# Altium project LP_ECG-X02.PrjPcb (part 1 of 3)
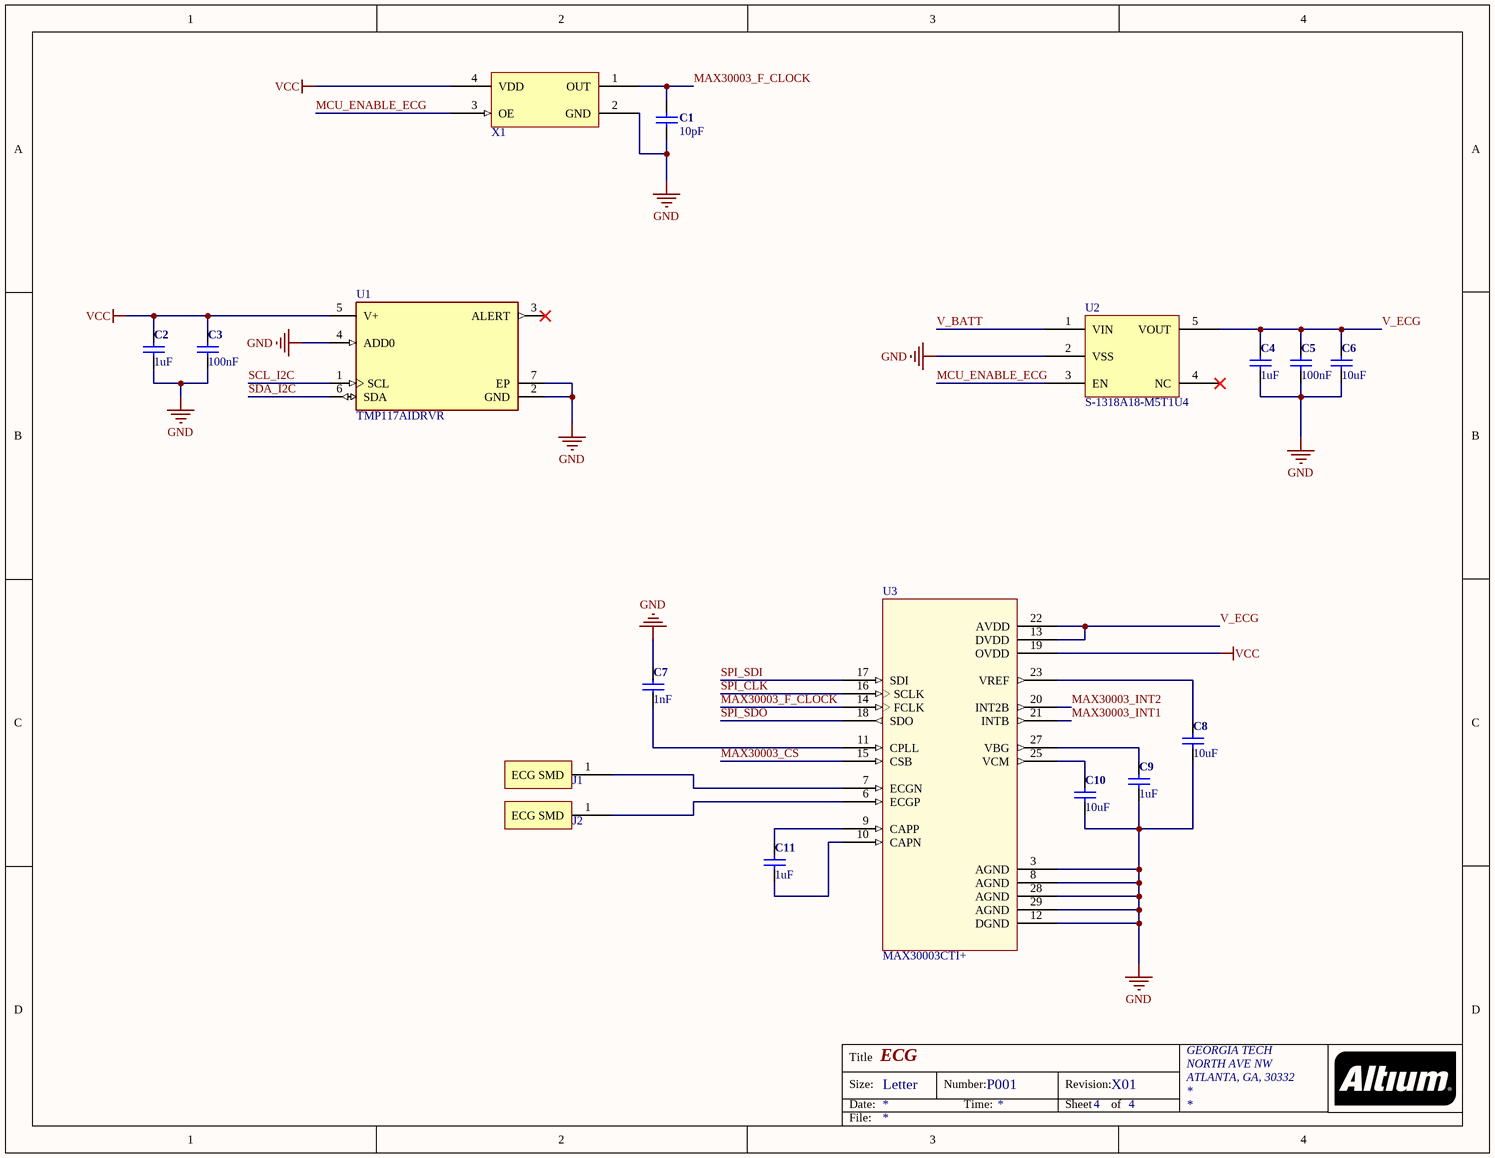
[diagram p0: LP_ECG_ECG-X02.SchDoc]
Author: C. DEMOLDER
3 sheets, 71 parts. Net scope: global (net labels, ports and power ports of the same name join across sheets).
Board file: LP_ECG-X02.PcbDoc
Sheets:
  LP_ECG_ECG-X02.SchDoc
  LP_ECG_Main-X02.SchDoc
  LP_ECG_Power-X02.SchDoc

## Sheet LP_ECG_ECG-X02.SchDoc: ECG
size Letter; Organization: GEORGIA TECH; Address1: NORTH AVE NW; Address2: ATLANTA, GA, 30332; DocumentNumber: P001; Revision: X01; SheetNumber: 4; SheetTotal: 4

### Parts
C1  10pF  [C0402]
C2  1uF  [C0402]
C3  100nF  [C0402]
C4  1uF  [C0402]
C5  100nF  [C0402]
C6  10uF  [C0402]
C7  1nF  [C0402]
C8  10uF  [C0402]
C9  1uF  [C0402]
C10  10uF  [C0402]
C11  1uF  [C0402]
J1  ECG_SMD_CONNECTOR  [ecg_connector]  (value not drawn)
J2  ECG_SMD_CONNECTOR  [ecg_connector]  (value not drawn)
U1  TMP117AIDRVR  [TMP117AIDRVR]
U2  S-1318A18-M5T1U4  [SOT-23-5]
U3  MAX30003CTI+  [QFN50P500X500X80-29N]
X1  OSCILLATOR-32.768KHZ  [OM-7605-C8-32.768KHZ]  (value not drawn)

### Nets
GND: C1.2 C2.2 C3.1 C4.2 C5.1 C6.2 C7.1 C8.2 C9.2 C10.2 U1.2(GND) U1.4(ADD0) U1.7(EP) U2.2(VSS) U3.3(AGND) U3.8(AGND) U3.12(DGND) U3.28(AGND) U3.29(AGND) X1.2(GND)
VCC: C2.1 C3.2 U1.5(V+) U3.19(OVDD) X1.4(VDD)
MAX30003_CS: U3.15(CSB)
MAX30003_F_CLOCK: C1.1 U3.14(FCLK) X1.1(OUT)
MAX30003_INT1: U3.21(INTB)
MAX30003_INT2: U3.20(INT2B)
MCU_ENABLE_ECG: U2.3(EN) X1.3(OE)
SCL_I2C: U1.1(SCL)
SDA_I2C: U1.6(SDA)
SPI_CLK: U3.16(SCLK)
SPI_SDI: U3.17(SDI)
SPI_SDO: U3.18(SDO)
V_BATT: U2.1(VIN)
V_ECG: C4.1 C5.2 C6.1 U2.5(VOUT) U3.13(DVDD) U3.22(AVDD)
NetC7_2: C7.2 U3.11(CPLL)
NetC8_1: C8.1 U3.23(VREF)
NetC9_1: C9.1 U3.27(VBG)
NetC10_1: C10.1 U3.25(VCM)
NetC11_1: C11.1 U3.9(CAPP)
NetC11_2: C11.2 U3.10(CAPN)
NetJ1_1: J1.1(ECG_SMD) U3.7(ECGN)
NetJ2_1: J2.1(ECG_SMD) U3.6(ECGP)

Not connected (* = marked no-connect by the designer): U1 3(ALERT)*; U2 4(NC)*

### Notes on the sheet
- Title
- Size:
- Date:
- Letter
- Number:
- Time:
- Revision:
- Sheet
- of
- File:

### Library data of the parts
C1 = C-0402(1005): Ceramic Capacitor, Multilayer, Ceramic, 50V, 5% +Tol, 5% -Tol, C0G, 30ppm/Cel TC, 0.00001uF, Surface Mount, 0402; Manufacturer: Murata; Manufacturer Part Number: GJM1555C1H100JB01D; Multilayer: Yes; Supplier 1: Digi-Key; Supplier Part Number 1: 490-3113-1-ND; RoHS: Yes; Category: Ceramic Capacitors; Stock 1: 1065586; Pricing 1: 1=0.25000, 10=0.17200, 50=0.10300, 100=0.08690, 500=0.05948, 1000=0.05262, 2500=0.05034, 5000=0.04576 (USD); Mount: Surface Mount; Number of Pins: 2; Dielectric Material: Ceramic; Package Shape: Rectangular; Size Code: 0402; Terminal Finish: Nickel; Min Operating Temperature: -55°C; Max Operating Temperature: 125°C; JESD-609 Code: e3; Capacitance: 10pF; Capacitor Type: Ceramic; Negative Tolerance: 5%; Package Style: SMTMeter; Packaging: Tape and Reel; Positive Tolerance: 5%; Rated DC Voltage (URdc): 50V; Temperature Characteristics Code: C0G; Termination: Wraparound; Length: 1mm; Width: 0.5mm; Height: 0.5mm; REACH SVHC: Yes; RoHS Compliant: Yes; ComponentLink1URL: https://datasheet.ciiva.com:443/pdfs/VipMasterIC/IC/MURE/MURE-S-A0004378008/MURE-S-A0004383508-1.pdf?src-supplier=IHS+Markit; ComponentLink1Description: https://datasheet.ciiva.com:443/pdfs/VipMasterIC/IC/MURE/MURE-S-A0004378008/MURE-S-A0004383508-1.pdf?src-supplier=IHS+Markit; ComponentLink2URL: https://datasheet.ciiva.com/18183/getdatasheetpartid-228488-18183804.pdf?src-supplier=Verical; ComponentLink2Description: https://datasheet.ciiva.com/18183/getdatasheetpartid-228488-18183804.pdf?src-supplier=Verical; ComponentLink3URL: https://datasheet.ciiva.com/165/partnumbering-e-01-165051.pdf?src-supplier=Digi-Key; ComponentLink3Description: https://datasheet.ciiva.com/165/partnumbering-e-01-165051.pdf?src-supplier=Digi-Key; ComponentLink4URL: https://datasheet.ciiva.com/29542/partnumbering-e-01-29542760.pdf?src-supplier=Digi-Key; ComponentLink4Description: https://datasheet.ciiva.com/29542/partnumbering-e-01-29542760.pdf?src-supplier=Digi-Key; ComponentLink5URL: https://datasheet.ciiva.com/29542/partnumbering-e-01-29542761.pdf?src-supplier=Digi-Key; ComponentLink5Description: https://datasheet.ciiva.com/29542/partnumbering-e-01-29542761.pdf?src-supplier=Digi-Key; ComponentLink6URL: https://datasheet.ciiva.com/11607/product-11607356.pdf?src-supplier=Avnet; ComponentLink6Description: https://datasheet.ciiva.com/11607/product-11607356.pdf?src-supplier=Avnet
C2 C4 C9 C11 = C-0402(1005): Ceramic Capacitor, Multilayer, Ceramic, 6.3V, 20% +Tol, 20% -Tol, X5R, 15% TC, 1uF, Surface Mount, 0402; Manufacturer: Yageo; Manufacturer Part Number: CC0402MRX5R5BB105; Dissipation Factor: 10%; ComponentLink1URL: https://datasheet.ciiva.com/169/product-169683.pdf; ComponentLink1Description: https://datasheet.ciiva.com/169/product-169683.pdf; Supplier 1: Digi-Key; Supplier Part Number 1: 311-1441-1-ND; RoHS: Yes; Category: Ceramic Capacitors; Stock 1: 16697; Pricing 1: 1=0.13000, 10=0.08900, 100=0.04200, 500=0.02946, 1000=0.02439, 2500=0.02270, 5000=0.02076 (USD); Mount: Surface Mount; Case/Package: 0402; Number of Pins: 2; Case Code (Imperial): 0402; Case Code (Metric): 1005; Min Operating Temperature: -55°C; Max Operating Temperature: 85°C; Capacitance: 1uF; Tolerance: 20%; Voltage Rating: 6.3V; Voltage Rating (DC): 6.3V; Packaging: Tape and Reel; Package Quantity: 1; Dielectric: X5R; Termination: SMD/SMT; Composition: Ceramic; Length: 1mm; Height: 0.5mm; Width: 0.5mm; Thickness: 0.022inch; Depth: 0.5mm; Lead Free: Lead Free; Halogen Free: Halogen Free; ComponentLink2URL: https://datasheet.ciiva.com:443/pdfs/VipMasterIC/IC/YAGO/YAGO-S-A0006851646/YAGO-S-A0006851646-1.pdf?src-supplier=IHS+Markit; ComponentLink2Description: https://datasheet.ciiva.com:443/pdfs/VipMasterIC/IC/YAGO/YAGO-S-A0006851646/YAGO-S-A0006851646-1.pdf?src-supplier=IHS+Markit; ComponentLink3URL: https://datasheet.ciiva.com/176/mlccorderingcode-176806.pdf?src-supplier=Digi-Key; ComponentLink3Description: https://datasheet.ciiva.com/176/mlccorderingcode-176806.pdf?src-supplier=Digi-Key; ComponentLink4URL: https://datasheet.ciiva.com/176/mlccorderingcode-176807.pdf?src-supplier=Digi-Key; ComponentLink4Description: https://datasheet.ciiva.com/176/mlccorderingcode-176807.pdf?src-supplier=Digi-Key; ComponentLink5URL: https://datasheet.ciiva.com/176/mlccorderingcode-176808.pdf?src-supplier=Digi-Key; ComponentLink5Description: https://datasheet.ciiva.com/176/mlccorderingcode-176808.pdf?src-supplier=Digi-Key
C3 C5 = C-0402(1005): Ceramic Capacitor, Multilayer, Ceramic, 25V, 10% +Tol, 10% -Tol, X5R, 15% TC, 0.1uF, Surface Mount, 0402; Manufacturer: Taiyo Yuden; Manufacturer Part Number: TMK105BJ104KV-F; ComponentLink1URL: https://datasheet.ciiva.com/169/product-169683.pdf; ComponentLink1Description: https://datasheet.ciiva.com/169/product-169683.pdf; Supplier 1: Digi-Key; Supplier Part Number 1: 587-1456-1-ND; RoHS: Yes; Category: Ceramic Capacitors; Stock 1: 27456801; Pricing 1: 1=0.10000, 10=0.04600, 100=0.02050, 500=0.01464, 1000=0.01150, 2500=0.01045, 5000=0.00961 (USD); Mount: Surface Mount; Case/Package: 0402; Number of Pins: 2; Weight: 2.3E-05oz; Case Code (Imperial): 0402; Case Code (Metric): 1005; Min Operating Temperature: -55°C; Max Operating Temperature: 85°C; Capacitance: 100nF; Tolerance: 10%; Packaging: Tape and Reel; Dielectric: X5R; Voltage Rating (DC): 25V; Voltage Rating: 25V; Package Quantity: 1; Termination: SMD/SMT; Composition: Ceramic; Voltage: 25V; Length: 1mm; Height: 0.5mm; Width: 0.5mm; Depth: 0.5mm; Thickness: 0.022inch; REACH SVHC: No SVHC; Lead Free: Lead Free; Halogen Free: Halogen Free; ComponentLink2URL: https://datasheet.ciiva.com:443/pdfs/VipMasterIC/IC/TAIY/TAIY-S-A0009103435/TAIY-S-A0009103038-1.pdf?src-supplier=IHS+Markit; ComponentLink2Description: https://datasheet.ciiva.com:443/pdfs/VipMasterIC/IC/TAIY/TAIY-S-A0009103435/TAIY-S-A0009103038-1.pdf?src-supplier=IHS+Markit; ComponentLink3URL: https://datasheet.ciiva.com/30051/25tmk105bj104kv-f-30051094.pdf?src-supplier=Onlinecomponents.com; ComponentLink3Description: https://datasheet.ciiva.com/30051/25tmk105bj104kv-f-30051094.pdf?src-supplier=Onlinecomponents.com; ComponentLink4URL: https://datasheet.ciiva.com/15922/28tmk105bj104kv-f-15922315.pdf?src-supplier=Onlinecomponents.com; ComponentLink4Description: https://datasheet.ciiva.com/15922/28tmk105bj104kv-f-15922315.pdf?src-supplier=Onlinecomponents.com; ComponentLink5URL: https://datasheet.ciiva.com/131/tmk105bj104kv-f-ss-131420.pdf?src-supplier=Digi-Key; ComponentLink5Description: https://datasheet.ciiva.com/131/tmk105bj104kv-f-ss-131420.pdf?src-supplier=Digi-Key; ComponentLink6URL: https://datasheet.ciiva.com/22768/1693457-22768649.pdf?src-supplier=Farnell; ComponentLink6Description: https://datasheet.ciiva.com/22768/1693457-22768649.pdf?src-supplier=Farnell
C6 C8 C10 = C-0402(1005): Ceramic Capacitor, Non-polarized, Multilayer, Ceramic, 10V, 20% +Tol, 20% -Tol, X5R, 15% TC, 10uF, Surface Mount, 0402; Manufacturer: Kyocera AVX; Manufacturer Part Number: 0402ZD106MAT2A; Multilayer: Yes; ComponentLink1URL: https://datasheet.ciiva.com/169/product-169683.pdf; ComponentLink1Description: https://datasheet.ciiva.com/169/product-169683.pdf; Supplier 1: Digi-Key; Supplier Part Number 1: 478-10052-1-ND; RoHS: No; Category: Ceramic Capacitors; Stock 1: 111382; Pricing 1: 1=0.85000, 10=0.62400, 50=0.49900, 100=0.42770, 500=0.33858, 1000=0.28512, 2500=0.26730, 5000=0.24948 (USD); Mount: Surface Mount; Number of Pins: 2; Dielectric Material: Ceramic; Package Shape: Rectangular; Size Code: 0402; Terminal Finish: Nickel; Min Operating Temperature: -55°C; Max Operating Temperature: 85°C; JESD-609 Code: e3; Capacitance: 10uF; Capacitor Type: Ceramic; Negative Tolerance: 20%; Packaging: Tape and Reel; Positive Tolerance: 20%; Rated DC Voltage (URdc): 10V; Temperature Characteristics Code: X5R; Termination: Wraparound; ComponentLink2URL: https://datasheet.ciiva.com:443/pdfs/VipMasterIC/IC/AVXC/AVXC-S-A0009640604/AVXC-S-A0009640604-1.pdf?src-supplier=IHS+Markit; ComponentLink2Description: https://datasheet.ciiva.com:443/pdfs/VipMasterIC/IC/AVXC/AVXC-S-A0009640604/AVXC-S-A0009640604-1.pdf?src-supplier=IHS+Markit; ComponentLink3URL: http://datasheets.avx.com/cx5r.pdf?src-supplier=Digi-Key; ComponentLink3Description: http://datasheets.avx.com/cx5r.pdf?src-supplier=Digi-Key; ComponentLink4URL: http://catalogs.avx.com/SurfaceMount.pdf?src-supplier=Digi-Key; ComponentLink4Description: http://catalogs.avx.com/SurfaceMount.pdf?src-supplier=Digi-Key
C7 = C-0402(1005): Ceramic Capacitor, Multilayer, Ceramic, 10V, 5% +Tol, 5% -Tol, C0G, -/+30ppm/Cel TC, 0.001uF, 0402; Manufacturer: KEMET; Manufacturer Part Number: C0402C102J8GAC7867; ComponentLink1URL: https://datasheet.ciiva.com/169/product-169683.pdf; ComponentLink1Description: https://datasheet.ciiva.com/169/product-169683.pdf; Supplier 1: Digi-Key; Supplier Part Number 1: 399-14868-1-ND; RoHS: No; Category: Ceramic Capacitors; Stock 1: 20757; Pricing 1: 1=0.26000, 10=0.18100, 100=0.10240, 500=0.07226, 1000=0.06322, 2500=0.06022, 5000=0.05570 (USD); Mount: Surface Mount; Case/Package: 0402; Case Code (Imperial): 0402; Case Code (Metric): 1005; Min Operating Temperature: -55°C; Max Operating Temperature: 125°C; Packaging: Tape and Reel; Capacitance: 1nF; Tolerance: 5%; Voltage Rating: 10V; ComponentLink2URL: https://datasheet.ciiva.com:443/pdfs/VipMasterIC/IC/KEME/KEMES02331/KEMES02331-1.pdf?src-supplier=IHS+Markit; ComponentLink2Description: https://datasheet.ciiva.com:443/pdfs/VipMasterIC/IC/KEME/KEMES02331/KEMES02331-1.pdf?src-supplier=IHS+Markit; ComponentLink3URL: https://api.kemet.com/component-edge/download/datasheet/C0402C102J8GAC7867.pdf?src-supplier=Digi-Key; ComponentLink3Description: https://api.kemet.com/component-edge/download/datasheet/C0402C102J8GAC7867.pdf?src-supplier=Digi-Key
J1 J2 = ECG_SMD_CONNECTOR: SMD CONNECTOR FOR ECG
U1 = bceab6869a9cb85cf5675529ee35ce4: TEMPERATURE SENSOR; Manufacturer: Texas Instruments; Operating Supply Current: 3.5-16uA; Standoff Height: 0mm; Min Supply Voltage: 1.8V; Resolution: 16bits; Interface: I2C,2-Wire,SMBus; Max Junction Temp: +150°C; Max Supply Voltage: 5.5V; Output Type: I2C; Octopart: https://octopart.com/tmp117aidrvr-texas+instruments-95511044; Lead Free: Yes; ComponentLink2Description: Datasheet; Temperature Range High: +150°C; Manufacturer Part Number: TMP117AIDRVR; Ambient Temperature Range High: +150°C; Ambient Temperature Range Low: -55°C; Height: 0.8mm; ComponentLink2URL: http://www.ti.com/lit/ds/symlink/tmp117.pdf; Automotive: No; Device Class L1: Sensors; RoHS: TRUE; Package: DRV0006A; Device Class L3: unset; Temperature: -55°C to +150°C; Temperature Range Low: -55°C; Ipc Land Pattern Name: DFN200X200X80-6; Device Class L2: Temperature and Humidity Sensors; Category: IC; Digikey Description: TEMPERATURE SENSOR; Supplier 1: Digi-Key; Supplier Part Number 1: 296-51834-1-ND; Stock 1: 3558; Pricing 1: 1=8.02000, 5=7.07600, 10=6.25000, 25=5.07040, 50=4.48100, 100=4.36300, 500=3.65552, 1000=3.41968 (USD); Mount: Surface Mount; Min Operating Temperature: -55°C; Max Operating Temperature: 150°C; Packaging: Cut Tape; ComponentLink1URL: https://www.ti.com:443/lit/ds/symlink/tmp117.pdf?src-supplier=IHS+Markit; ComponentLink1Description: https://www.ti.com:443/lit/ds/symlink/tmp117.pdf?src-supplier=IHS+Markit; ComponentLink3URL: http://www.ti.com/lit/gpn/tmp117?src-supplier=Digi-Key; ComponentLink3Description: http://www.ti.com/lit/gpn/tmp117?src-supplier=Digi-Key
U2 = S-1318A18-M5T1U4: Fixed Positive LDO Regulator; Manufacturer: ABLIC; Regulator Type: FIXED POSITIVE SINGLE OUTPUT LDO REGULATOR; Supplier 1: Digi-Key; Supplier Part Number 1: 1662-S-1318A18-M5T1U4CT-ND; Manufacturer Part Number: S-1318A18-M5T1U4; RoHS: Yes; Stock 1: 2394; Pricing 1: 1=1.15000, 10=1.02600, 25=0.97360, 100=0.79970, 250=0.74752, 500=0.66060, 1000=0.52152 (USD); REACH SVHC: No SVHC; RoHS Compliant: No; ComponentLink1URL: https://datasheet.ciiva.com:443/pdfs/VipMasterIC/IC/ABLI/ABLI-S-A0006756278/ABLI-S-A0006756278-1.pdf?src-supplier=IHS+Markit; ComponentLink1Description: https://datasheet.ciiva.com:443/pdfs/VipMasterIC/IC/ABLI/ABLI-S-A0006756278/ABLI-S-A0006756278-1.pdf?src-supplier=IHS+Markit
U3 = MAX30003CTI+: Analog Circuit, 1 Func, CMOS; Manufacturer: Maxim; Min Supply Voltage: 1.2V; Max Supply Voltage: 2V; Supplier 1: Digi-Key; Supplier Part Number 1: MAX30003CTI+-ND; RoHS: No; Category: RF Semiconductors and Devices; Stock 1: 286; Pricing 1: 1=8.21000, 10=7.41200, 25=7.06760, 100=5.86090, 250=5.34380, 500=4.99902, 1000=4.98888 (USD); Number of Pins: 28; Min Operating Temperature: 0°C; Max Operating Temperature: 70°C; REACH SVHC: No SVHC; ComponentLink1URL: https://datasheet.ciiva.com:443/pdfs/VipMasterIC/IC/MAXM/MAXM-S-A0009086108/MAXM-S-A0009086108-1.pdf?src-supplier=IHS+Markit; ComponentLink1Description: https://datasheet.ciiva.com:443/pdfs/VipMasterIC/IC/MAXM/MAXM-S-A0009086108/MAXM-S-A0009086108-1.pdf?src-supplier=IHS+Markit; ComponentLink2URL: http://www.farnell.com/datasheets/2159846.pdf?src-supplier=Farnell; ComponentLink2Description: http://www.farnell.com/datasheets/2159846.pdf?src-supplier=Farnell; ComponentLink3URL: https://pdfserv.maximintegrated.com/en/an/MAX-ECG-MONITOR-User-Guide.pdf?src-supplier=Digi-Key; ComponentLink3Description: https://pdfserv.maximintegrated.com/en/an/MAX-ECG-MONITOR-User-Guide.pdf?src-supplier=Digi-Key; ComponentLink4URL: http://www.farnell.com/datasheets/2159846.pdf?src-supplier=Element14; ComponentLink4Description: http://www.farnell.com/datasheets/2159846.pdf?src-supplier=Element14; Manufacturer Part Number: MAX30003CTI+
X1 = OM-7605-C8-32.768KHZ: Osc Xo 32.768KHZ SMD; Manufacturer: Micro Crystal; Manufacturer Part Number: OM-7605-C8-32.768KHZ-20PPM-TA-QC; Supplier 1: Digi-Key; Supplier Part Number 1: 2195-OM-7605-C8-32.768KHZ-20PPM-TA-QCCT-ND; RoHS: No; Stock 1: 564; Pricing 1: 1=1.94000, 10=1.85700, 50=1.81340, 100=1.55430, 500=1.51112 (USD)